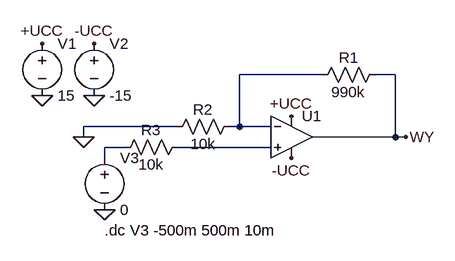
[diagram p0: schematic opampzad5.asc]
opampzad5.asc, the LTspice schematic file:
Version 4.1
SHEET 1 880 680
WIRE 272 80 144 80
WIRE 384 80 352 80
WIRE 48 160 -96 160
WIRE 144 160 144 80
WIRE 144 160 128 160
WIRE 192 160 144 160
WIRE -96 176 -96 160
WIRE 384 176 384 80
WIRE 384 176 256 176
WIRE 400 176 384 176
WIRE -32 192 -64 192
WIRE 192 192 48 192
WIRE -64 208 -64 192
FLAG -80 112 0
FLAG -160 112 0
FLAG -160 32 +UCC
FLAG -80 32 -UCC
FLAG 224 208 -UCC
FLAG 224 144 +UCC
FLAG -64 288 0
FLAG -96 176 0
FLAG 400 176 WY
SYMBOL OpAmps\\UniversalOpAmp2 224 176 R0
SYMATTR InstName U1
SYMATTR SpiceLine Ilimit=25m Rail=2.2 Vos=1.8m
SYMBOL res 368 64 R90
WINDOW 0 5 56 VBottom 2
WINDOW 3 27 56 VTop 2
SYMATTR InstName R1
SYMATTR Value 990k
SYMBOL res 144 144 R90
WINDOW 0 5 56 VBottom 2
WINDOW 3 27 56 VTop 2
SYMATTR InstName R2
SYMATTR Value 10k
SYMBOL voltage -160 16 R0
WINDOW 123 0 0 Left 0
WINDOW 39 0 0 Left 0
SYMATTR InstName V1
SYMATTR Value 15
SYMBOL voltage -80 16 R0
WINDOW 123 0 0 Left 0
WINDOW 39 0 0 Left 0
SYMATTR InstName V2
SYMATTR Value -15
SYMBOL res 64 176 R90
WINDOW 0 5 56 VBottom 2
WINDOW 3 27 56 VTop 2
SYMATTR InstName R3
SYMATTR Value 10k
SYMBOL voltage -64 192 R0
WINDOW 123 0 0 Left 0
WINDOW 39 0 0 Left 0
SYMATTR InstName V3
SYMATTR Value 0
TEXT -64 320 Left 2 !.dc V3 -500m 500m 10m

The netlist it stands for:
* opampzad5.asc
X§U1 N003 N001 +UCC -UCC WY level2 Avol=1Meg GBW=10Meg Slew=10Meg Ilimit=25m Rail=2.2 Vos=1.8m En=0 Enk=0 In=0 Ink=0 Rin=500Meg  ; pins In+ In- V+ V- OUT
R1 WY N001 990k
R2 N001 0 10k
V1 +UCC 0 15
V2 -UCC 0 -15
R3 N003 N002 10k
V3 N002 0 0
.dc V3 -500m 500m 10m
.lib UniversalOpAmp2.lib
.backanno
.end